# Altium schematic sheet Top.SchDoc
size A4; SheetNumber: 1; SheetTotal: 3
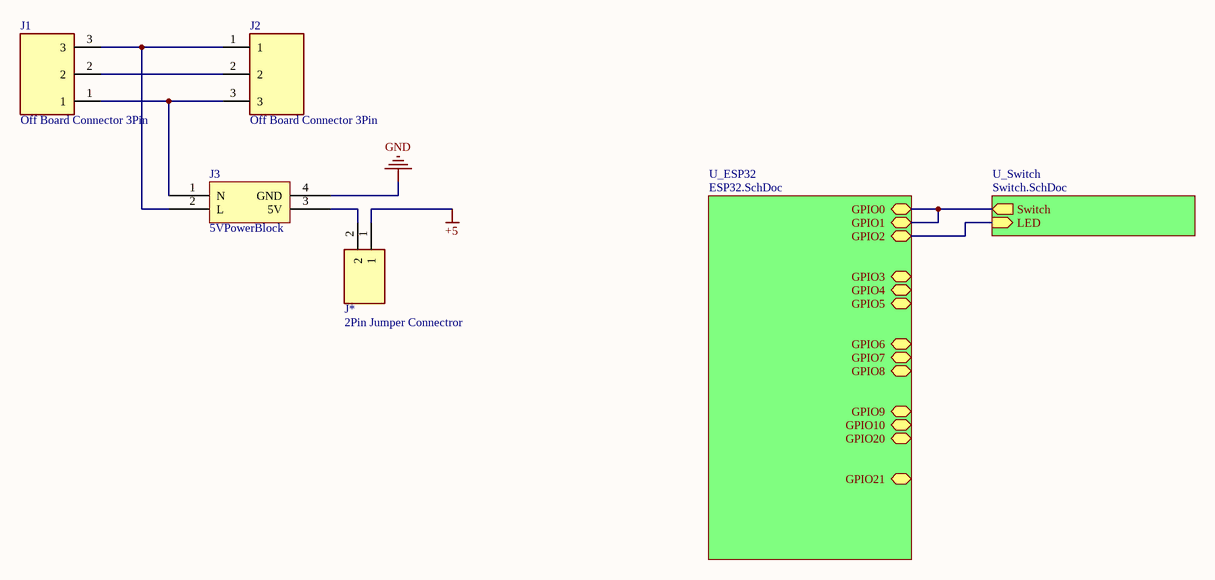
[diagram p0: Top.SchDoc]

## Parts
J1  Off Board Connector 3Pin  [OFF BORAD CONNECTOR 3PIN]
J2  Off Board Connector 3Pin  [OFF BORAD CONNECTOR 3PIN]
J3  5VPowerBlock  [5VPowerBlock]
J*  2Pin Jumper Connectror  [2Pin Jumper]

## Sub-sheets
U_ESP32 = ESP32.SchDoc: GPIO21 (bidir), GPIO20 (bidir), GPIO10 (bidir), GPIO9 (bidir), GPIO8 (bidir), GPIO7 (bidir), GPIO6 (bidir), GPIO5 (bidir), GPIO0 (bidir), GPIO1 (bidir), GPIO2 (bidir), GPIO3 (bidir), GPIO4 (bidir)
U_Switch = Switch.SchDoc: LED (in), Switch (out)

## Nets
+5: J*.1
GND: J3.4(GND)
NetJ1_1: J1.1 J2.3 J3.1(N)
NetJ1_2: J1.2 J2.2
NetJ1_3: J1.3 J2.1 J3.2(L)
NetJ3_3: J3.3(5V) J*.2
(unnamed): sheet U_ESP32/GPIO0, sheet U_ESP32/GPIO1, sheet U_Switch/Switch
(unnamed): sheet U_ESP32/GPIO2, sheet U_Switch/LED

## Library data of the parts
J1 J2 = CMP-007-000001-2: Screw Connector; Design Item ID: Off Board Connector 3Pin; Source: Basic.SchLib
J3 = CMP-012-000011-1: Source: Basic.SchLib; Design Item ID: 5VPowerBlock
J* = CMP-007-000002-1